# Altium schematic sheet Single_12V.SchDoc
size A4
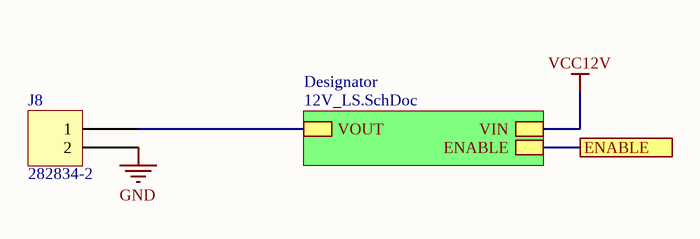
[diagram p0: Single_12V.SchDoc]

## Parts
J8  282834-2  [TE 282834-2]

## Sub-sheets
Designator = 12V_LS.SchDoc: VIN, VOUT, ENABLE

## Ports
ENABLE

## Nets
GND: J8.2
VCC12V: sheet Designator/VIN
ENABLE: port ENABLE, sheet Designator/ENABLE
NetJ8_1: J8.1 ; sheet Designator/VOUT

## Library data of the parts
J8 = 282834-2: TERM BLK 2P SIDE ENT 2.54MM PCB; Manufacturer: TE Connectivity AMP Connectors; Current: 10A; Mating Orientation: Horizontal with Board; Number of Levels: 1; Pitch: 0.100" (2.54mm); Positions Per Level: 2; Voltage: 150V; Wire Gauge: 16-30 AWG; Wire Termination: Screw - Rising Cage Clamp; Part Number: 282834-2; Color: Green; ComponentLink1Description: Datasheet; ComponentLink1URL: https://www.te.com/commerce/DocumentDelivery/DDEController?Action=srchrtrv&DocNm=282834&DocType=Customer+Drawing&DocLang=English; ComponentLink2Description: DigiKey Link; ComponentLink2URL: http://digikey.com/product-detail/en/te-connectivity-amp-connectors/282834-2/A98333-ND/1150135; LastUpdated: 2020-01-15 4:15:38 AM; Lifecycle Status: Active; Minimum Order: 1; Mounting Type: Through Hole; Packaging: Bulk; Part Status: Active; Price: 0.88; Series: Buchanan; Supplier 1: DigiKey; Supplier Part Number 1: A98333-ND